# Altium schematic sheet MCU.SchDoc
size A
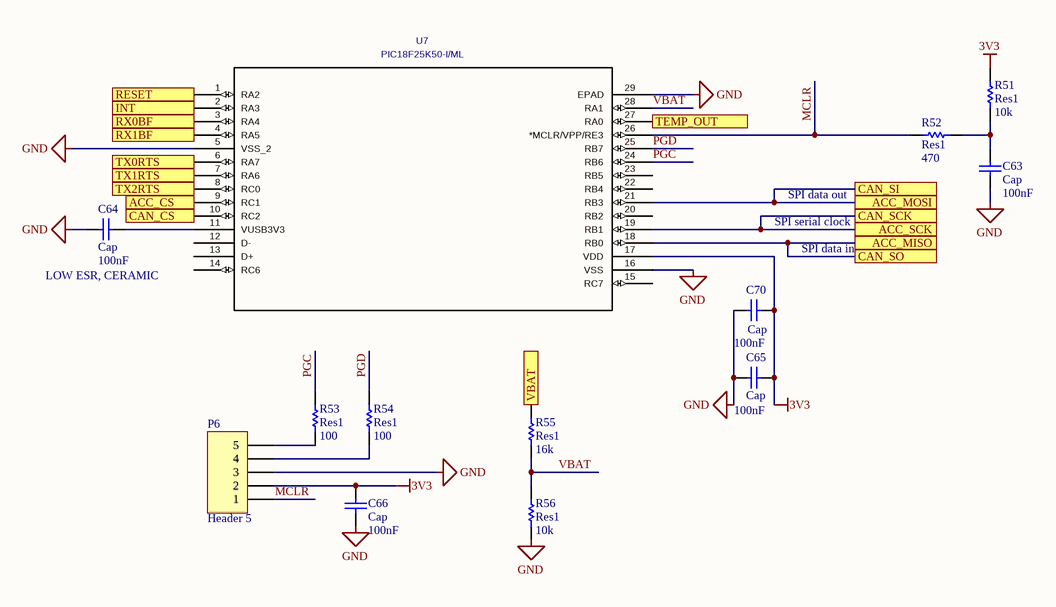
[diagram p0: MCU.SchDoc]

## Parts
C63  Cap  value 100nF  [0402-A]
C64  Cap  value 100nF  [0402-A]
C65  Cap  value 100nF  [0402-A]
C66  Cap  value 100nF  [0402-A]
C70  Cap  value 100nF  [0402-A]
P6  Header 5  [HDR1X5]
R51  Res1  value 10k  [0402-A]
R52  Res1  value 470  [0402-A]
R53  Res1  value 100  [0402-A]
R54  Res1  value 100  [0402-A]
R55  Res1  value 16k  [0402-A]
R56  Res1  value 10k  [0402-A]
U7  PIC18F25K50-I/ML  [QFN28_6X6MC_MCH]

## Ports
ACC_CS, ACC_MISO, ACC_MOSI, ACC_SCK, CAN_CS, CAN_SCK, CAN_SI, CAN_SO, INT, RESET, RX0BF, RX1BF, TEMP_OUT, TX0RTS, TX1RTS, TX2RTS, VBAT

## Nets
3V3: C65.2 C66.2 C70.2 P6.2 R51.2 U7.17(VDD)
GND: C63.1 C64.1 C65.1 C66.1 C70.1 P6.3 R56.1 U7.5(VSS_2) U7.16(VSS) U7.29(EPAD)
ACC_CS: U7.9(RC1) ; port ACC_CS
ACC_MISO: U7.18(RB0) ; port ACC_MISO, port CAN_SO
ACC_MOSI: U7.21(RB3) ; port ACC_MOSI, port CAN_SI
ACC_SCK: U7.19(RB1) ; port ACC_SCK, port CAN_SCK
CAN_CS: U7.10(RC2) ; port CAN_CS
INT: U7.2(RA3) ; port INT
MCLR: P6.1 R52.2 U7.26(*MCLR/VPP/RE3)
PGC: R53.2 U7.24(RB6)
PGD: R54.2 U7.25(RB7)
RESET: U7.1(RA2) ; port RESET
RX0BF: U7.3(RA4) ; port RX0BF
RX1BF: U7.4(RA5) ; port RX1BF
TEMP_OUT: U7.27(RA0) ; port TEMP_OUT
TX0RTS: U7.6(RA7) ; port TX0RTS
TX1RTS: U7.7(RA6) ; port TX1RTS
TX2RTS: U7.8(RC0) ; port TX2RTS
VBAT: R55.1 R56.2 U7.28(RA1)
VBAT: R55.2 ; port VBAT  [a separate net that carries the same name]
NetC63_2: C63.2 R51.1 R52.1
NetC64_2: C64.2 U7.11(VUSB3V3)
NetP6_4: P6.4 R54.1
NetP6_5: P6.5 R53.1

Not connected (* = marked no-connect by the designer): U7 12(D-) 13(D+) 14(RC6) 15(RC7) 20(RB2) 22(RB4) 23(RB5)

## Notes on the sheet
- SPI data out
- SPI serial clock
- SPI data in
- (near C64) LOW ESR, CERAMIC

## Library data of the parts
C63-C66 C70 = Cap: Capacitor; Published: 8-Jun-2000; LatestRevisionDate: 17-Jul-2002; LatestRevisionNote: Re-released for DXP Platform.; PackageReference: RAD-0.3; Publisher: Altium Limited; PackageDescription: Radial Cap, Thru-Hole; 2 Leads; 0.3 in Pin Spacing
P6 = Header 5: Header, 5-Pin; LatestRevisionDate: 17-Jul-2002; LatestRevisionNote: Re-released for DXP Platform.; Publisher: Altium Limited
R51-R56 = Res1: Resistor; Published: 8-Jun-2000; LatestRevisionDate: 17-Jul-2002; LatestRevisionNote: Re-released for DXP Platform.; PackageReference: AXIAL-0.3; Publisher: Altium Limited; PackageDescription: Axial Device, Thru-Hole; 2 Leads; 0.3 in Pin Spacing
U7 = PIC18F25K50-I/ML: C: Copyright (C) 2015 Accelerated Designs. All rights reserved; Vendor: Microchip; Built_By: EMA_UL_Team; SourceLibrary: Microchip_2014-11-20; Value: PIC18F25K50-I/ML; Manufacturer_Part_Number: PIC18F25K50-I/ML